# Altium project Dual_BLDC_Controller.PrjPcb
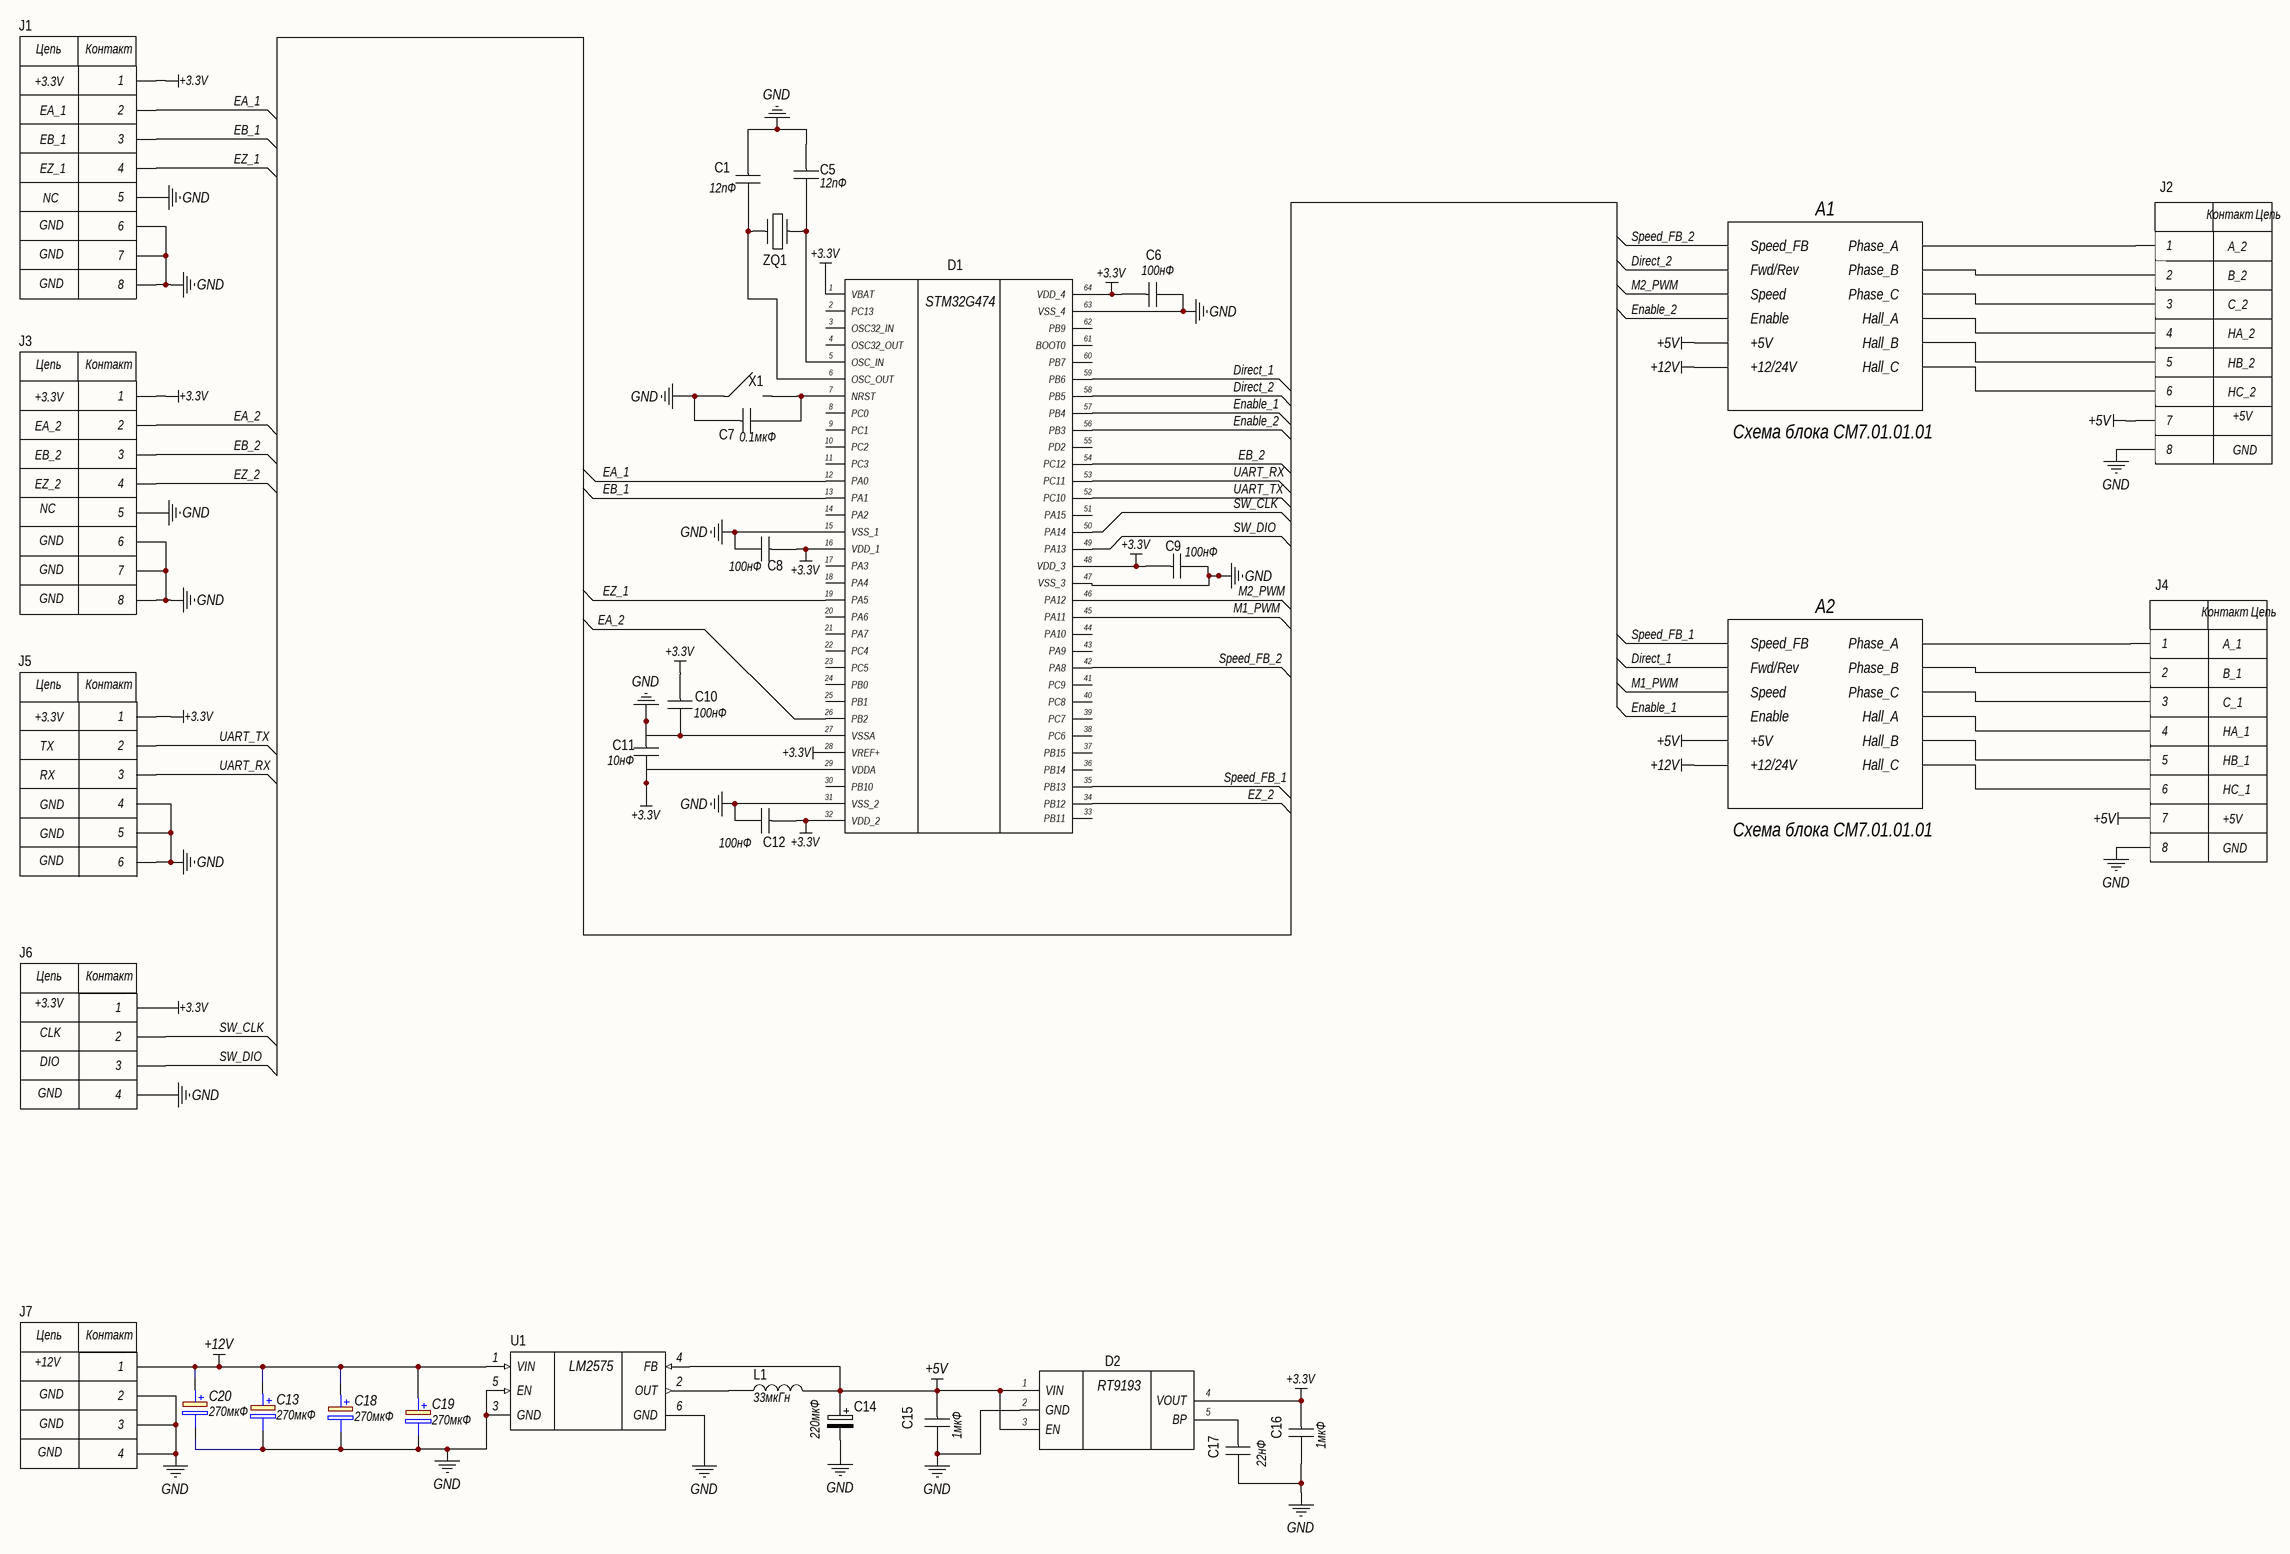
[diagram p0: Схема_принципиальная_общая.SchDoc]
2 sheets, 106 parts. Net scope: hierarchical (ports join the sheet entries above them; power ports are global).
Board file: PCB_board.PcbDoc
Sheets:
  Схема_принципиальная_общая.SchDoc
    A2 = Схема_принципиальная_JY01.SchDoc
    A1 = Схема_принципиальная_JY01.SchDoc

## Sheet Схема_принципиальная_общая.SchDoc
size 594 x 420 mm; Date: 10.12.2024; CheckedBy: Гуляев И.А.; Author: Санников А.К.; CompanyName: МГТУ им.Н.Э.Баумана; Organization: МГТУ им.Н.Э.Баумана; SheetNumber: 1; SheetTotal: 2; Name1: Плата управления; DecimalNumber: СМ7.01.01.00; Name2: двухосевого привода

### Parts
C1  12пФ  [CAPC1608X87N]
C5  12пФ  [CAPC1608X87N]
C6  100нФ  [CAPC1608X87N]
C7  0.1мкФ  [CAPC1608X87N]
C8  100нФ  [CAPC1608X87N]
C9  100нФ  [CAPC1608X87N]
C10  100нФ  [CAPC1608X87N]
C11  10нФ  [CAPC1608X87N]
C12  100нФ  [CAPC1608X87N]
C13  270мкФ  [16SVF270M]
C14  220мкФ  [CAPPM3216X180N]
C15  1мкФ  [CAPC1608X87N]
C16  1мкФ  [CAPC1608X87N]
C17  22нФ  [CAPC1608X87N]
C18  270мкФ  [16SVF270M]
C19  270мкФ  [16SVF270M]
C20  270мкФ  [16SVF270M]
D1  (no value)  [QFP50P1200X1200X160-64N]
D2  (no value)  [RT9193]
J1  BM06B-SRSS-TB_LF__SN_  [BM06BSRSSTBLFSN]  (value not drawn)
J2  430450800  [MOLEX_430450800]  (value not drawn)
J3  BM06B-SRSS-TB_LF__SN_  [BM06BSRSSTBLFSN]  (value not drawn)
J4  430450800  [MOLEX_430450800]  (value not drawn)
J5  BM04B-SRSS-TB_LFSN_  [BM04BSRSSTBLFSN]  (value not drawn)
J6  4-pin header  [4-pin header]  (value not drawn)
J7  XT30PW-M  [XT30PWM]  (value not drawn)
L1  33мкГн  [INDPM7373X450N]
U1  LM2575HVSX-5.0_NOPB  [VREG_LM2575HVSX-5.0_NOPB]  (value not drawn)
X1  1437566-3  [14375663]  (value not drawn)
ZQ1  NX5032GA-12.000M-LN-CD-1  [INDC5032X150N]  (value not drawn)

### Sub-sheets
A1 = Схема_принципиальная_JY01.SchDoc: Phase_A (bidir), Phase_B (bidir), Phase_C (bidir), Hall_A (bidir), Hall_B (bidir), Hall_C (bidir), Speed_FB (bidir), Fwd/Rev (bidir), Speed (bidir), Enable (bidir), +5V (bidir), +12/24V (bidir)
A2 = Схема_принципиальная_JY01.SchDoc: Phase_A (bidir), Phase_B (bidir), Phase_C (bidir), Hall_A (bidir), Hall_B (bidir), Hall_C (bidir), Speed_FB (bidir), Fwd/Rev (bidir), Speed (bidir), Enable (bidir), +5V (bidir), +12/24V (bidir)

### Nets
+3.3V: C6.2 C8.2 C9.2 C10.2 C11.1 C12.2 C16.2 D1.1(VBAT) D1.16(VDD_1) D1.28(VREF+) D1.29(VDDA) D1.32(VDD_2) D1.48(VDD_3) D1.64(VDD_4) D2.4(VOUT) J1.1 J3.1 J5.1 J6.1
+5V: C14.1(+) C15.2 D2.1(VIN) D2.3(EN) J2.7 J4.7 L1.2 U1.4(FB) ; sheet A2/+5V, sheet A1/+5V
+12V: C13.1(+) C18.1(+) C19.1(+) C20.1(+) J7.1 U1.1(VIN) ; sheet A2/+12/24V, sheet A1/+12/24V
GND: C1.2 C5.2 C6.1 C7.2 C8.1 C9.1 C10.1 C11.2 C12.1 C13.2(-) C14.2(-) C15.1 C16.1 C17.1 C18.2(-) C19.2(-) C20.2(-) D1.15(VSS_1) D1.27(VSSA) D1.31(VSS_2) D1.47(VSS_3) D1.63(VSS_4) D2.2(GND) J1.5 J1.6 J1.7 J1.8 J2.8 J3.5 J3.6 J3.7 J3.8 J4.8 J5.4 J5.MP1(5) J5.MP2(6) J6.4 J7.2 J7.3 J7.4 U1.3(GND) U1.5(EN) U1.6(GND) X1.1
Direct_1: D1.59(PB6) ; sheet A2/Fwd/Rev
Direct_2: D1.58(PB5) ; sheet A1/Fwd/Rev
EA_1: D1.12(PA0) J1.2
EA_2: D1.26(PB2) J3.2
EB_1: D1.13(PA1) J1.3
EB_2: D1.54(PC12) J3.3
Enable_1: D1.57(PB4) ; sheet A2/Enable
Enable_2: D1.56(PB3) ; sheet A1/Enable
EZ_1: D1.19(PA5) J1.4
EZ_2: D1.34(PB12) J3.4
Ha: J2.4 ; sheet A1/Hall_A
Ha: J4.4 ; sheet A2/Hall_A  [a separate net that carries the same name]
Hb: J2.5 ; sheet A1/Hall_B
Hb: J4.5 ; sheet A2/Hall_B  [a separate net that carries the same name]
Hc: J2.6 ; sheet A1/Hall_C
Hc: J4.6 ; sheet A2/Hall_C  [a separate net that carries the same name]
M1_PWM: D1.45(PA11) ; sheet A2/Speed
M2_PWM: D1.46(PA12) ; sheet A1/Speed
Speed_FB_1: D1.35(PB13) ; sheet A2/Speed_FB
Speed_FB_2: D1.42(PA8) ; sheet A1/Speed_FB
SW_CLK: D1.50(PA14) J6.2
SW_DIO: D1.49(PA13) J6.3
UART_RX: D1.53(PC11) J5.3
UART_TX: D1.52(PC10) J5.2
NetB1_A1_6: J2.1 ; sheet A1/Phase_A
NetB1_A2_6: J4.1 ; sheet A2/Phase_A
NetB3_A1_6: J2.2 ; sheet A1/Phase_B
NetB3_A2_6: J4.2 ; sheet A2/Phase_B
NetB5_A1_6: J2.3 ; sheet A1/Phase_C
NetB5_A2_6: J4.3 ; sheet A2/Phase_C
NetC1_1: C1.1 D1.6(OSC_OUT) ZQ1.1
NetC5_1: C5.1 D1.5(OSC_IN) ZQ1.2
NetC7_1: C7.1 D1.7(NRST) X1.2
NetC17_2: C17.2 D2.5(BP)
NetL1_1: L1.1 U1.2(OUT)

Not connected (* = marked no-connect by the designer): D1 2(PC13) 3(OSC32_IN) 4(OSC32_OUT) 8(PC0) 9(PC1) 10(PC2) 11(PC3) 14(PA2) 17(PA3) 18(PA4) 20(PA6) 21(PA7) 22(PC4) 23(PC5) 24(PB0) 25(PB1) 30(PB10) 33(PB11) 36(PB14) 37(PB15) 38(PC6) 39(PC7) 40(PC8) 41(PC9) 43(PA9) 44(PA10) 51(PA15) 55(PD2) 60(PB7) 61(BOOT0) 62(PB9)

### Notes on the sheet
- +3.3V
- EA_1
- EB_1
- EZ_1
- NC
- A_2
- B_2
- HA_2
- C_2
- HB_2
- HC_2
- EA_2
- EB_2
- Схема блока СМ7.01.01.01
- GND
- +5V
- EZ_2
- A_1
- B_1
- C_1
- TX
- RX
- HA_1
- HB_1
- HC_1
- DIO
- CLK
- +12V
- Перв.примен.
- Справ.№
- Подп. и дата
- Инв.№ дубл.
- Взам.инв.№
- Подп.и дата
- Разраб.
- Изм.
- Лист
- № докум.
- Подп.
- Дата
- Лит.
- Масштаб
- Масса
- Т.контр.
- Пров.
- Схема электрическая
- Принципиальная
- Листов
- Инв.№ подл.
- Утв.
- Н.контр.
- Нач.сект.
- Формат  A2
- (in symbol 4-pin header) Цепь; Контакт; GND
- (in symbol 430450800) Контакт; Цепь
- (in symbol BM04B-SRSS-TB_LFSN_) Цепь; Контакт; GND
- (in symbol BM06B-SRSS-TB_LF__SN_) Цепь; Контакт; GND
- (in symbol LM2575HVSX-5.0_NOPB) LM2575
- (in symbol STM32G474RBT6) STM32G474
- (in symbol XT30PW-M) Цепь; Контакт; GND

### Library data of the parts
C1 C5-C12 C15-C17 = C0603: C 0603; Manufacturer_Name: KEMET; Manufacturer_Part_Number: C0603C222K4REC7411; Geometry.Height: 0.87mm; Mouser Part Number: *; Mouser Price/Stock: *; Arrow Part Number: *; Arrow Price/Stock: *; Datasheet Link: https://www.kemet.com/specsheet/C0603C222K4REC7411
C13 C18-C20 = 25SVPF100M: Capacitor Polarised; Manufacturer_Name: Panasonic; Datasheet Link: http://industrial.panasonic.com/cdbs/www-data/pdf/AAB8000/AAB8000C177.pdf; Height: 7mm; Manufacturer_Part_Number: 25SVPF100M; Mouser Part Number: 667-25SVPF100M; Mouser Price/Stock: https://www.mouser.co.uk/ProductDetail/Panasonic/25SVPF100M?qs=OE1iw1LrrPHrTLW3S9d9vQ%3D%3D; Arrow Part Number: 25SVPF100M; Arrow Price/Stock: https://www.arrow.com/en/products/25svpf100m/panasonic?region=nac
C14 = TAJA104K050R: Capacitor tantalum TAJ 1206 100nF 50V AVX 100nF SMD Solid MnO2 Tantalum Electrolytic Capacitor, 50 V dc +/-10%, TAJ Series; Manufacturer_Name: Kyocera AVX; Geometry.Height: 1.8mm; Manufacturer_Part_Number: TAJA104K050R; Mouser Part Number: N/A; Mouser Price/Stock: http://www.mouser.com/Search/ProductDetail.aspx?qs=TDs2sH6HKGut6%252bATQXwpTg%3d%3d; Arrow Part Number: *; Arrow Price/Stock: *; Datasheet Link: http://www.farnell.com/datasheets/1680476.pdf
D1 = STM32G474RBT6: LQFP is a 64 pins, 10 x 10 mm low-profile quad flat package.; Manufacturer_Name: STMicroelectronics; Geometry.Height: 1.6mm; Manufacturer_Part_Number: STM32G474RBT6; Mouser Part Number: 511-STM32G474RBT6; Mouser Price/Stock: https://www.mouser.co.uk/ProductDetail/STMicroelectronics/STM32G474RBT6?qs=uwxL4vQweFP0uAZUZXLBhQ%3D%3D; Arrow Part Number: STM32G474RBT6; Arrow Price/Stock: https://www.arrow.com/en/products/stm32g474rbt6/stmicroelectronics?region=nac; Datasheet Link: https://www.mouser.com/datasheet/2/389/stm32g474cb-1600828.pdf
D2 = RT9193
J1 J3 = BM06B-SRSS-TB_LF__SN_: Wire To Board / Wire To Wire Connector RoHS; Manufacturer_Name: JST (JAPAN SOLDERLESS TERMINALS); Manufacturer_Part_Number: BM06B-SRSS-TB(LF)(SN); Geometry.Height: 4.25mm; Mouser Part Number: N/A; Mouser Price/Stock: https://www.mouser.co.uk/ProductDetail/JST-Commercial/BM06B-SRSS-TBLFSN?qs=IKkN%2F947nfAcbKIXx%2F1kIg%3D%3D; Arrow Part Number: BM06B-SRSS-TB(LF)(SN); Arrow Price/Stock: https://www.arrow.com/en/products/bm06b-srss-tb-lf-sn/jst-manufacturing?region=europe; Datasheet Link: http://www.jst-mfg.com/product/pdf/eng/eSR.pdf
J5 = BM04B-SRSS-TB_LFSN_: JST SH, 4 Way, 1 Row, Straight PCB Header; Manufacturer_Name: JST (JAPAN SOLDERLESS TERMINALS); Manufacturer_Part_Number: BM04B-SRSS-TB(LFSN); Geometry.Height: 4.25mm; Mouser Part Number: *; Mouser Price/Stock: *; Arrow Part Number: BM04B-SRSS-TB(LFSN); Arrow Price/Stock: https://www.arrow.com/en/products/bm04b-srss-tb-lf-sn/jst-manufacturing?region=europe; Datasheet Link: http://uk.rs-online.com/web/p/products/5151541P
J7 = XT30PW-M: 30A Low Temperature Rise Fire Retardant Plug; Manufacturer_Name: Amass; Geometry.Height: 5mm; Manufacturer_Part_Number: XT30PW-M; Mouser Part Number: *; Mouser Price/Stock: *; Arrow Part Number: *; Arrow Price/Stock: *; Datasheet Link: https://www.tme.eu/sl/Document/ce4077e36b79046da520ca73227e15de/XT30PW%20SPEC.pdf
L1 = B82472G6332M000: SMD / SMT Inductors (Coils), L=3.3uH, 7.3mm x 7.3mm; Manufacturer_Name: TDK; Geometry.Height: 4.5mm; Manufacturer_Part_Number: B82472G6332M000; Mouser Part Number: 871-B82472G6332M000; Mouser Price/Stock: https://www.mouser.co.uk/ProductDetail/EPCOS-TDK/B82472G6332M000?qs=x3Z3TaiycdvLmjm0xB%2FIcA%3D%3D; Arrow Part Number: *; Arrow Price/Stock: *; Datasheet Link: https://product.tdk.com/system/files/dam/doc/product/inductor/inductor/smd/data_sheet/30/db/ind_2008/b82472g6.pdf
U1 = LM2575HVSX-5.0_NOPB: Buck Switching Regulator IC Positive Fixed 5V 1 Output 1A TO-263-6, D2PAK (5 Leads + Tab), TO-263BA; MF: Microchip; MP: LM2575-5.0WU; SnapEDA_Link: https://www.snapeda.com/parts/LM2575-5.0WU/Microchip/view-part/?ref=snap; Package: TO-263-5 Microchip; Value: *; Check_prices: https://www.snapeda.com/parts/LM2575-5.0WU/Microchip/view-part/?ref=eda
X1 = 1437566-3: 1437566-3 - PUSHBUTTON SWITCH, SPST, 0.05A, 24V; Manufacturer_Name: TE Connectivity; Geometry.Height: 4.57mm; Manufacturer_Part_Number: 1437566-3; Mouser Part Number: N/A; Mouser Price/Stock: https://www.mouser.co.uk/ProductDetail/TE-Connectivity-Alcoswitch/1437566-3?qs=xoXDFGdkQ2nqx7TKB39mxQ%3D%3D; Arrow Part Number: 1437566-3; Arrow Price/Stock: https://www.arrow.com/en/products/1437566-3/te-connectivity?region=europe; Datasheet Link: https://www.te.com/commerce/DocumentDelivery/DDEController?Action=showdoc&DocId=Customer+Drawing%7F1437566-3%7FC2%7Fpdf%7FEnglish%7FENG_CD_1437566-3_C2_1437566_3_1_c.dwg.pdf%7F1437566-3
ZQ1 = NX5032GA-8.000M: Crystals CRYSTAL 8MHZ 8PF SMD; Manufacturer_Name: NDK; Geometry.Height: 1.5mm; Manufacturer_Part_Number: NX5032GA-12.000M-LN-CD-1; Mouser Part Number: 344-NX5032GA12MLNCD1; Mouser Price/Stock: https://www.mouser.co.uk/ProductDetail/NDK/NX5032GA-12.000M-LN-CD-1?qs=55YtniHzbhA6vGHH627DAQ%3D%3D; Arrow Part Number: *; Arrow Price/Stock: *; Datasheet Link: https://componentsearchengine.com/Datasheets/1/NX5032GA-12.000M-LN-CD-1.pdf
J2 J4 = 430450800: Value: *; Price: None; MP: 430450800; Availability: Unavailable; Package: None

## Sheet Схема_принципиальная_JY01.SchDoc: Наименование
size 420 x 297 mm; CheckedBy: Гуляев И.А.; Author: Санников А.К.; CompanyName: МГТУ им.Н.Э.Баумана; SheetNumber: 2; SheetTotal: 2; PageSetup: Record=PageOptions|CenterHorizontal=True|CenterVertical=True|PrintScale=0.94|XCorrection=1.00|YCorrection=1.00|PrintKind=1|BorderSize=5000000|LeftOffset=0|BottomOffset=0|Orientation=1|PaperLength=1000|PaperWidth=1000|Scale=100|PaperSource=7|PrintQuality=-4|MediaType=1|DitherType=10|PaperKind=A4|PrintScaleMode=1; DecimalNumber: СМ7.01.01.01; MainDevice: Перв.примен.; Name1: Усилитель мощности; Name2: оси привода; DocumentName: Sheet1.SCHDOC
Used 2 times, as channels A2, A1. Parts and nets are listed once, with the designators drawn on the sheet.
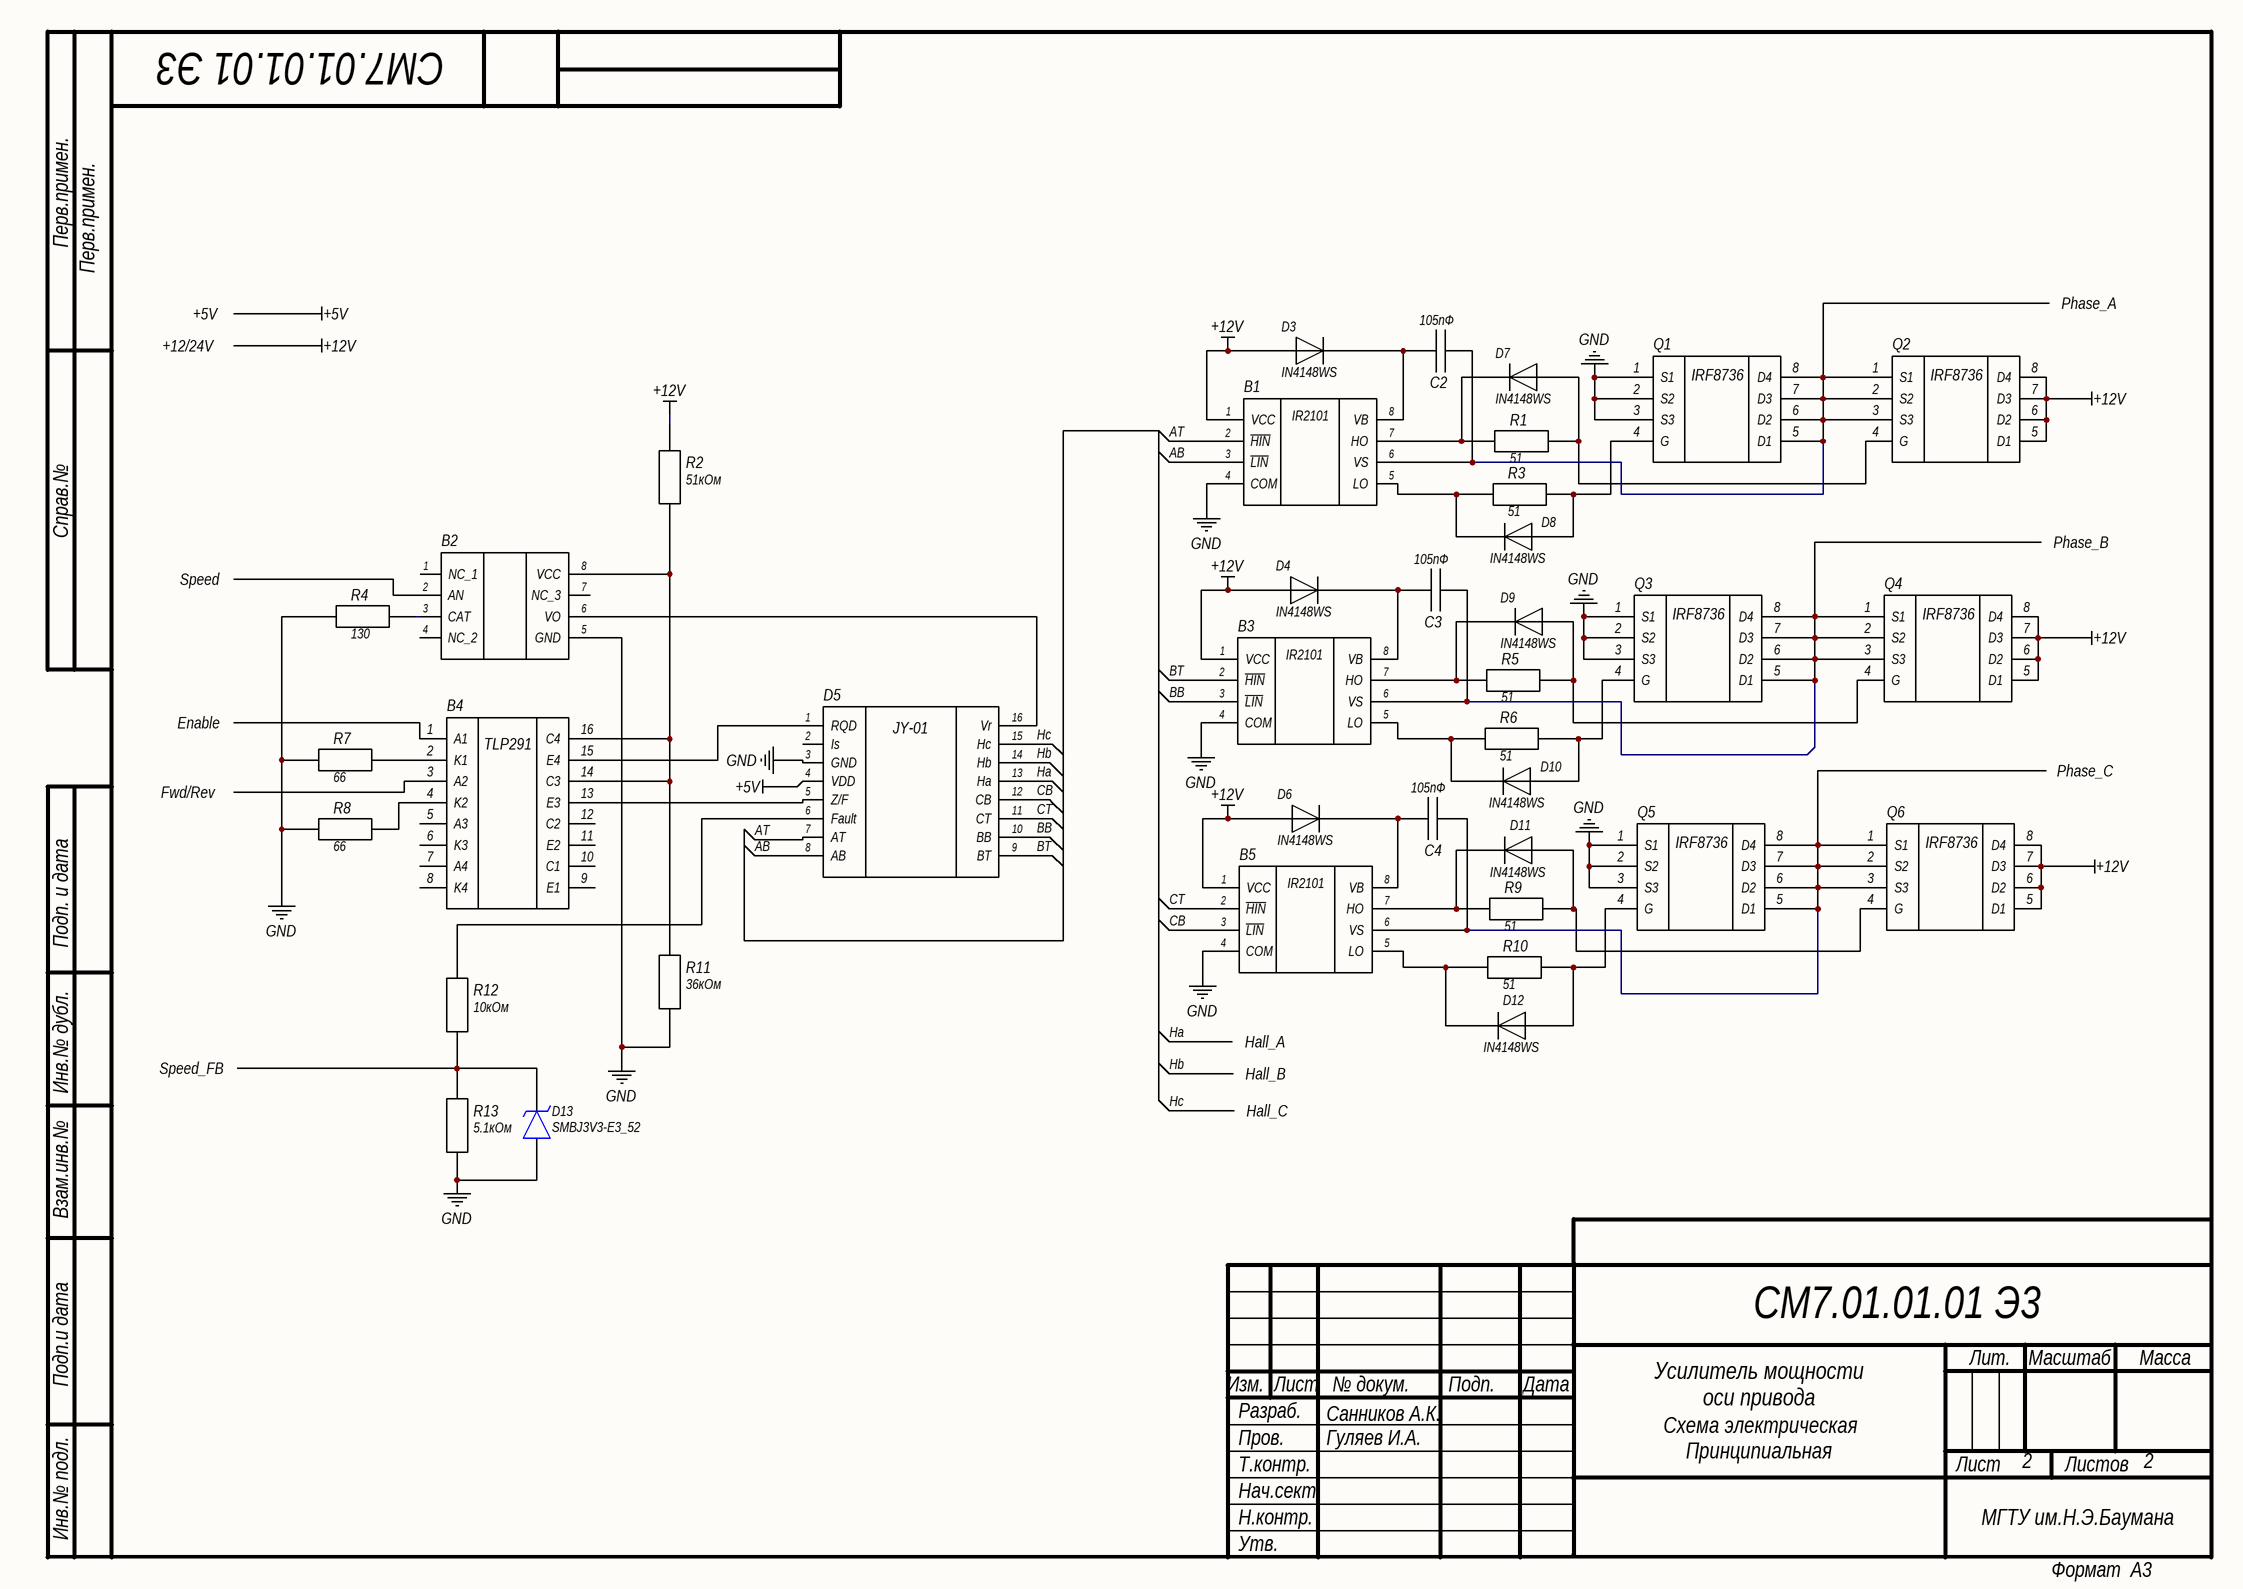
[diagram p1: Схема_принципиальная_JY01.SchDoc]

### Parts
B1  IR2101S  [SOIC127P600X175-8N]  (value not drawn)
B2  HCPL-4504-000E  [DIP762W65P254L965H470Q8N]  (value not drawn)
B3  IR2101S  [SOIC127P600X175-8N]  (value not drawn)
B4  TLP291-4_GB_E_T  [SOIC127P700X220-16N]  (value not drawn)
B5  IR2101S  [SOIC127P600X175-8N]  (value not drawn)
C2  105пФ  [CAPC1608X87N]
C3  105пФ  [CAPC1608X87N]
C4  105пФ  [CAPC1608X87N]
D3  IN4148WS  [SOD2713X115N]
D4  IN4148WS  [SOD2713X115N]
D5  JY01-SOP16  [SOIC127P600X175-16N]  (value not drawn)
D6  IN4148WS  [SOD2713X115N]
D7  IN4148WS  [SOD2713X115N]
D8  IN4148WS  [SOD2713X115N]
D9  IN4148WS  [SOD2713X115N]
D10  IN4148WS  [SOD2713X115N]
D11  IN4148WS  [SOD2713X115N]
D12  IN4148WS  [SOD2713X115N]
D13  SMBJ3V3-E3_52  [DIOM5436X244N]
Q1  IRF8736PBF  [SOIC127P600X175-8N]  (value not drawn)
Q2  IRF8736PBF  [SOIC127P600X175-8N]  (value not drawn)
Q3  IRF8736PBF  [SOIC127P600X175-8N]  (value not drawn)
Q4  IRF8736PBF  [SOIC127P600X175-8N]  (value not drawn)
Q5  IRF8736PBF  [SOIC127P600X175-8N]  (value not drawn)
Q6  IRF8736PBF  [SOIC127P600X175-8N]  (value not drawn)
R1  51  [RESC1608X55N]
R2  51кОм  [RESC1608X55N]
R3  51  [RESC1608X55N]
R4  130  [RESC1608X55N]
R5  51  [RESC1608X55N]
R6  51  [RESC1608X55N]
R7  66  [RESC1608X55N]
R8  66  [RESC1608X55N]
R9  51  [RESC1608X55N]
R10  51  [RESC1608X55N]
R11  36кОм  [RESC1608X55N]
R12  10кОм  [RESC1608X55N]
R13  5.1кОм  [RESC1608X55N]

### Ports
+5V (bidir, see Схема_принципиальная_общая[3B]), +12/24V (bidir, see Схема_принципиальная_общая[3B]), Enable (bidir, see Схема_принципиальная_общая[3B]), Fwd/Rev (bidir, see Схема_принципиальная_общая[3B]), Hall_A (bidir, see Схема_принципиальная_общая[4B]), Hall_B (bidir, see Схема_принципиальная_общая[4B]), Hall_C (bidir, see Схема_принципиальная_общая[4B]), Phase_A (bidir, see Схема_принципиальная_общая[4B]), Phase_B (bidir, see Схема_принципиальная_общая[4B]), Phase_C (bidir, see Схема_принципиальная_общая[4B]), Speed (bidir, see Схема_принципиальная_общая[3B]), Speed_FB (bidir, see Схема_принципиальная_общая[3B])

### Nets
+5V: D5.4(VDD) ; port +5V
+12V: B1.1(VCC) B3.1(VCC) B5.1(VCC) D3.2(A) D4.2(A) D6.2(A) Q2.5(D1) Q2.6(D2) Q2.7(D3) Q2.8(D4) Q4.5(D1) Q4.6(D2) Q4.7(D3) Q4.8(D4) Q6.5(D1) Q6.6(D2) Q6.7(D3) Q6.8(D4) R2.2 ; port +12/24V
GND: B1.4(COM) B2.5(GND) B3.4(COM) B5.4(COM) D5.3(GND) D13.2(A) Q1.1(S1) Q1.2(S2) Q1.3(S3) Q3.1(S1) Q3.2(S2) Q3.3(S3) Q5.1(S1) Q5.2(S2) Q5.3(S3) R4.1 R7.1 R8.1 R11.1 R13.1
AB: B1.3(~{LIN}) D5.8(AB)
AT: B1.2(~{HIN}) D5.7(AT)
BB: B3.3(~{LIN}) D5.10(BB)
BT: B3.2(~{HIN}) D5.9(BT)
CB: B5.3(~{LIN}) D5.12(CB)
CT: B5.2(~{HIN}) D5.11(CT)
Enable: B4.1(A1) ; port Enable
Fwd/Rev: B4.3(A2) ; port Fwd/Rev
Ha: D5.13(Ha) ; port Hall_A
Hb: D5.14(Hb) ; port Hall_B
Hc: D5.15(Hc) ; port Hall_C
Phase_A: B1.6(VS) C2.1 Q1.5(D1) Q1.6(D2) Q1.7(D3) Q1.8(D4) Q2.1(S1) Q2.2(S2) Q2.3(S3) ; port Phase_A
Phase_B: B3.6(VS) C3.1 Q3.5(D1) Q3.6(D2) Q3.7(D3) Q3.8(D4) Q4.1(S1) Q4.2(S2) Q4.3(S3) ; port Phase_B
Phase_C: B5.6(VS) C4.1 Q5.5(D1) Q5.6(D2) Q5.7(D3) Q5.8(D4) Q6.1(S1) Q6.2(S2) Q6.3(S3) ; port Phase_C
Speed: B2.2(AN) ; port Speed
Speed_FB: D13.1(K) R12.1 R13.2 ; port Speed_FB
NetB1_5: B1.5(LO) D8.1(K) R3.1
NetB1_7: B1.7(HO) D7.1(K) R1.1
NetB1_8: B1.8(VB) C2.2 D3.1(K)
NetB2_3: B2.3(CAT) R4.2
NetB2_6: B2.6(VO) D5.16(Vr)
NetB2_8: B2.8(VCC) B4.14(C3) B4.16(C4) R2.1 R11.2
NetB3_5: B3.5(LO) D10.1(K) R6.1
NetB3_7: B3.7(HO) D9.1(K) R5.1
NetB3_8: B3.8(VB) C3.2 D4.1(K)
NetB4_2: B4.2(K1) R7.2
NetB4_4: B4.4(K2) R8.2
NetB4_13: B4.13(E3) D5.5(Z/F)
NetB4_15: B4.15(E4) D5.1(RQD)
NetB5_5: B5.5(LO) D12.1(K) R10.1
NetB5_7: B5.7(HO) D11.1(K) R9.1
NetB5_8: B5.8(VB) C4.2 D6.1(K)
NetD5_6: D5.6(Fault) R12.2
NetD7_2: D7.2(A) Q2.4(G) R1.2
NetD8_2: D8.2(A) Q1.4(G) R3.2
NetD9_2: D9.2(A) Q4.4(G) R5.2
NetD10_2: D10.2(A) Q3.4(G) R6.2
NetD11_2: D11.2(A) Q6.4(G) R9.2
NetD12_2: D12.2(A) Q5.4(G) R10.2

Not connected (* = marked no-connect by the designer): B2 1(NC_1) 4(NC_2) 7(NC_3); B4 5(A3) 6(K3) 7(A4) 8(K4) 9(E1) 10(C1) 11(E2) 12(C2); D5 2(Is)

### Channels
A2: designators end in _A2; ports +5V=+5V +12/24V=+12V Enable=Enable_1 Fwd/Rev=Direct_1 Hall_A=Ha Hall_B=Hb Hall_C=Hc Phase_A=NetB1_A2_6 Phase_B=NetB3_A2_6 Phase_C=NetB5_A2_6 Speed=M1_PWM Speed_FB=Speed_FB_1
A1: designators end in _A1; ports +5V=+5V +12/24V=+12V Enable=Enable_2 Fwd/Rev=Direct_2 Hall_A=Ha Hall_B=Hb Hall_C=Hc Phase_A=NetB1_A1_6 Phase_B=NetB3_A1_6 Phase_C=NetB5_A1_6 Speed=M2_PWM Speed_FB=Speed_FB_2

### Notes on the sheet
- Перв.примен.
- Справ.№
- Подп. и дата
- Инв.№ дубл.
- Взам.инв.№
- Подп.и дата
- Разраб.
- Изм.
- Лист
- № докум.
- Подп.
- Дата
- Лит.
- Масштаб
- Масса
- Т.контр.
- Пров.
- Принципиальная
- Схема электрическая
- Листов
- Инв.№ подл.
- Утв.
- Н.контр.
- Нач.сект.
- Формат  A3
- (in symbol IR2101S) IR2101
- (in symbol IRF8736PBF) IRF8736
- (in symbol JY01-SOP16) JY-01
- (in symbol TLP291-4_GB_E_T) TLP291

### Library data of the parts
B1 B3 B5 = IR2101S: IC GATE DRVR HALF-BRIDGE 8SOIC; Manufacturer_Name: Infineon; Geometry.Height: 1.75mm; Manufacturer_Part_Number: IR2101S; Mouser Part Number: *; Mouser Price/Stock: *; Arrow Part Number: *; Arrow Price/Stock: *; Datasheet Link: https://pdf1.alldatasheet.com/datasheet-pdf/view/102221/IRF/IR2101S.html
B2 = HCPL-4504-000E: Optocoupler, Transistor Output, 1 Channel, DIP, 8 Pins, 25 mA, 3.75 kV, 25 %; Manufacturer_Name: Avago Technologies; Geometry.Height: 4.7mm; Manufacturer_Part_Number: HCPL-4504-000E; Mouser Part Number: 630-HCPL-4504-000E; Mouser Price/Stock: https://www.mouser.co.uk/ProductDetail/Broadcom-Avago/HCPL-4504-000E?qs=s%252BgfxR24RQ6uFOvNhu%252ByDw%3D%3D; Arrow Part Number: *; Arrow Price/Stock: *; Datasheet Link: https://componentsearchengine.com/Datasheets/2/HCPL-4504-000E.pdf
B4 = TLP291-4_GB_E_T: Photocoupler, Tr, 2.3mm, DC, SO16; Manufacturer_Name: Toshiba; Manufacturer_Part_Number: TLP291-4(GB,E(T; Geometry.Height: 2.2mm; Mouser Part Number: *; Mouser Price/Stock: *; Arrow Part Number: TLP291-4(GB,E(T; Arrow Price/Stock: https://www.arrow.com/en/products/tlp291-4-gbe-t/toshiba?region=europe; Datasheet Link: http://toshiba.semicon-storage.com/info/docget.jsp?did=12858&prodName=TLP291-4
C2-C4 = C0603: as C1 on sheet Схема_принципиальная_общая; Mouser Part Number: *; Mouser Price/Stock: *; Arrow Part Number: *; Arrow Price/Stock: *; Datasheet Link: https://www.kemet.com/specsheet/C0603C222K4REC7411
D3 D4 D6-D12 = IN4148WS: Small Signal Fast Switching Diode; Manufacturer_Name: Vishay; Geometry.Height: 1.15mm; Manufacturer_Part_Number: IN4148WS; Mouser Part Number: *; Mouser Price/Stock: *; Arrow Part Number: *; Arrow Price/Stock: *; Datasheet Link: https://docs.rs-online.com/69cb/0900766b80dd2a8d.pdf
D5 = JY01-SOP16: BLDC FOC Controller; Manufacturer_Name: China; Geometry.Height: 1.75mm; Manufacturer_Part_Number: JY01-SOP16; Mouser Part Number: *; Mouser Price/Stock: *; Arrow Part Number: *; Arrow Price/Stock: *; Datasheet Link: http://www.lenzetech.com/public/store/pdf/jsggs/AC6969A%C2%A0Datasheet%C2%A0V1.0.pdf
D13 = SMBJ3V3-E3_52: TVS Diode (Uni-directional); Manufacturer_Name: Vishay; Manufacturer_Part_Number: SMBJ3V3-E3/52; Datasheet Link: http://www.farnell.com/datasheets/2244846.pdf; Height: 2.44mm; Mouser Part Number: 625-SMBJ3V3-E3; Mouser Price/Stock: https://www.mouser.co.uk/ProductDetail/Vishay-General-Semiconductor/SMBJ3V3-E3-52?qs=%252BKsK5HlK7GG3a%2FL90gCz%2Fg%3D%3D; Arrow Part Number: SMBJ3V3-E3/52; Arrow Price/Stock: https://www.arrow.com/en/products/smbj3v3-e352/vishay?region=nac
Q1-Q6 = IRF8736PBF: Infineon IRF8736PBF N-channel MOSFET, 18 A, 30 V HEXFET, 8-Pin SOIC; Geometry.Height: 1.75mm; Manufacturer_Name: Infineon; Manufacturer_Part_Number: IRF8736PBF; Mouser Part Number: 942-IRF8736PBF; Mouser Price/Stock: https://www.mouser.co.uk/ProductDetail/Infineon-IR/IRF8736PBF?qs=Z8%252BeY1k3TII91Qkl2E%252BuQw%3D%3D; Arrow Part Number: IRF8736PBF; Arrow Price/Stock: https://www.arrow.com/en/products/irf8736pbf/infineon-technologies-ag; Datasheet Link: https://www.infineon.com/dgdl/irf8736pbf.pdf?fileId=5546d462533600a40153560d9e661d7f
R1-R13 = R0603: Resistor 0603 Case 150 +/-0.1% 0.063W +/-25ppm/C; Manufacturer_Name: TE Connectivity; Manufacturer_Part_Number: CPF0603B150RE; Geometry.Height: 0.55mm; Mouser Part Number: *; Mouser Price/Stock: *; Arrow Part Number: *; Arrow Price/Stock: *; Datasheet Link: http://www.farnell.com/datasheets/1786775.pdf

## Nets that join several sheets
+5V: Схема_принципиальная_общая (8 pins), A2 (D5_A2.4), A1 (D5_A1.4)
+12V: Схема_принципиальная_общая (6 pins), A2 (19 pins), A1 (19 pins)
GND: Схема_принципиальная_общая (44 pins), A2 (20 pins), A1 (20 pins)
Direct_1: Схема_принципиальная_общая (D1.59), A2 (B4_A2.3)
Direct_2: Схема_принципиальная_общая (D1.58), A1 (B4_A1.3)
Enable_1: Схема_принципиальная_общая (D1.57), A2 (B4_A2.1)
Enable_2: Схема_принципиальная_общая (D1.56), A1 (B4_A1.1)
Ha: Схема_принципиальная_общая (J2.4), A1 (D5_A1.13)
Ha: Схема_принципиальная_общая (J4.4), A2 (D5_A2.13)
Hb: Схема_принципиальная_общая (J2.5), A1 (D5_A1.14)
Hb: Схема_принципиальная_общая (J4.5), A2 (D5_A2.14)
Hc: Схема_принципиальная_общая (J2.6), A1 (D5_A1.15)
Hc: Схема_принципиальная_общая (J4.6), A2 (D5_A2.15)
M1_PWM: Схема_принципиальная_общая (D1.45), A2 (B2_A2.2)
M2_PWM: Схема_принципиальная_общая (D1.46), A1 (B2_A1.2)
NetB1_A1_6: Схема_принципиальная_общая (J2.1), A1 (9 pins)
NetB1_A2_6: Схема_принципиальная_общая (J4.1), A2 (9 pins)
NetB3_A1_6: Схема_принципиальная_общая (J2.2), A1 (9 pins)
NetB3_A2_6: Схема_принципиальная_общая (J4.2), A2 (9 pins)
NetB5_A1_6: Схема_принципиальная_общая (J2.3), A1 (9 pins)
NetB5_A2_6: Схема_принципиальная_общая (J4.3), A2 (9 pins)
Speed_FB_1: Схема_принципиальная_общая (D1.35), A2 (D13_A2.1 R12_A2.1 R13_A2.2)
Speed_FB_2: Схема_принципиальная_общая (D1.42), A1 (D13_A1.1 R12_A1.1 R13_A1.2)